# EasyEDA schematic Camera_IR.json
TITLE: Counter_Water; REV: 1.0; Date: 2025-07-06; Sheet: 1/1; Company: Museum of Science
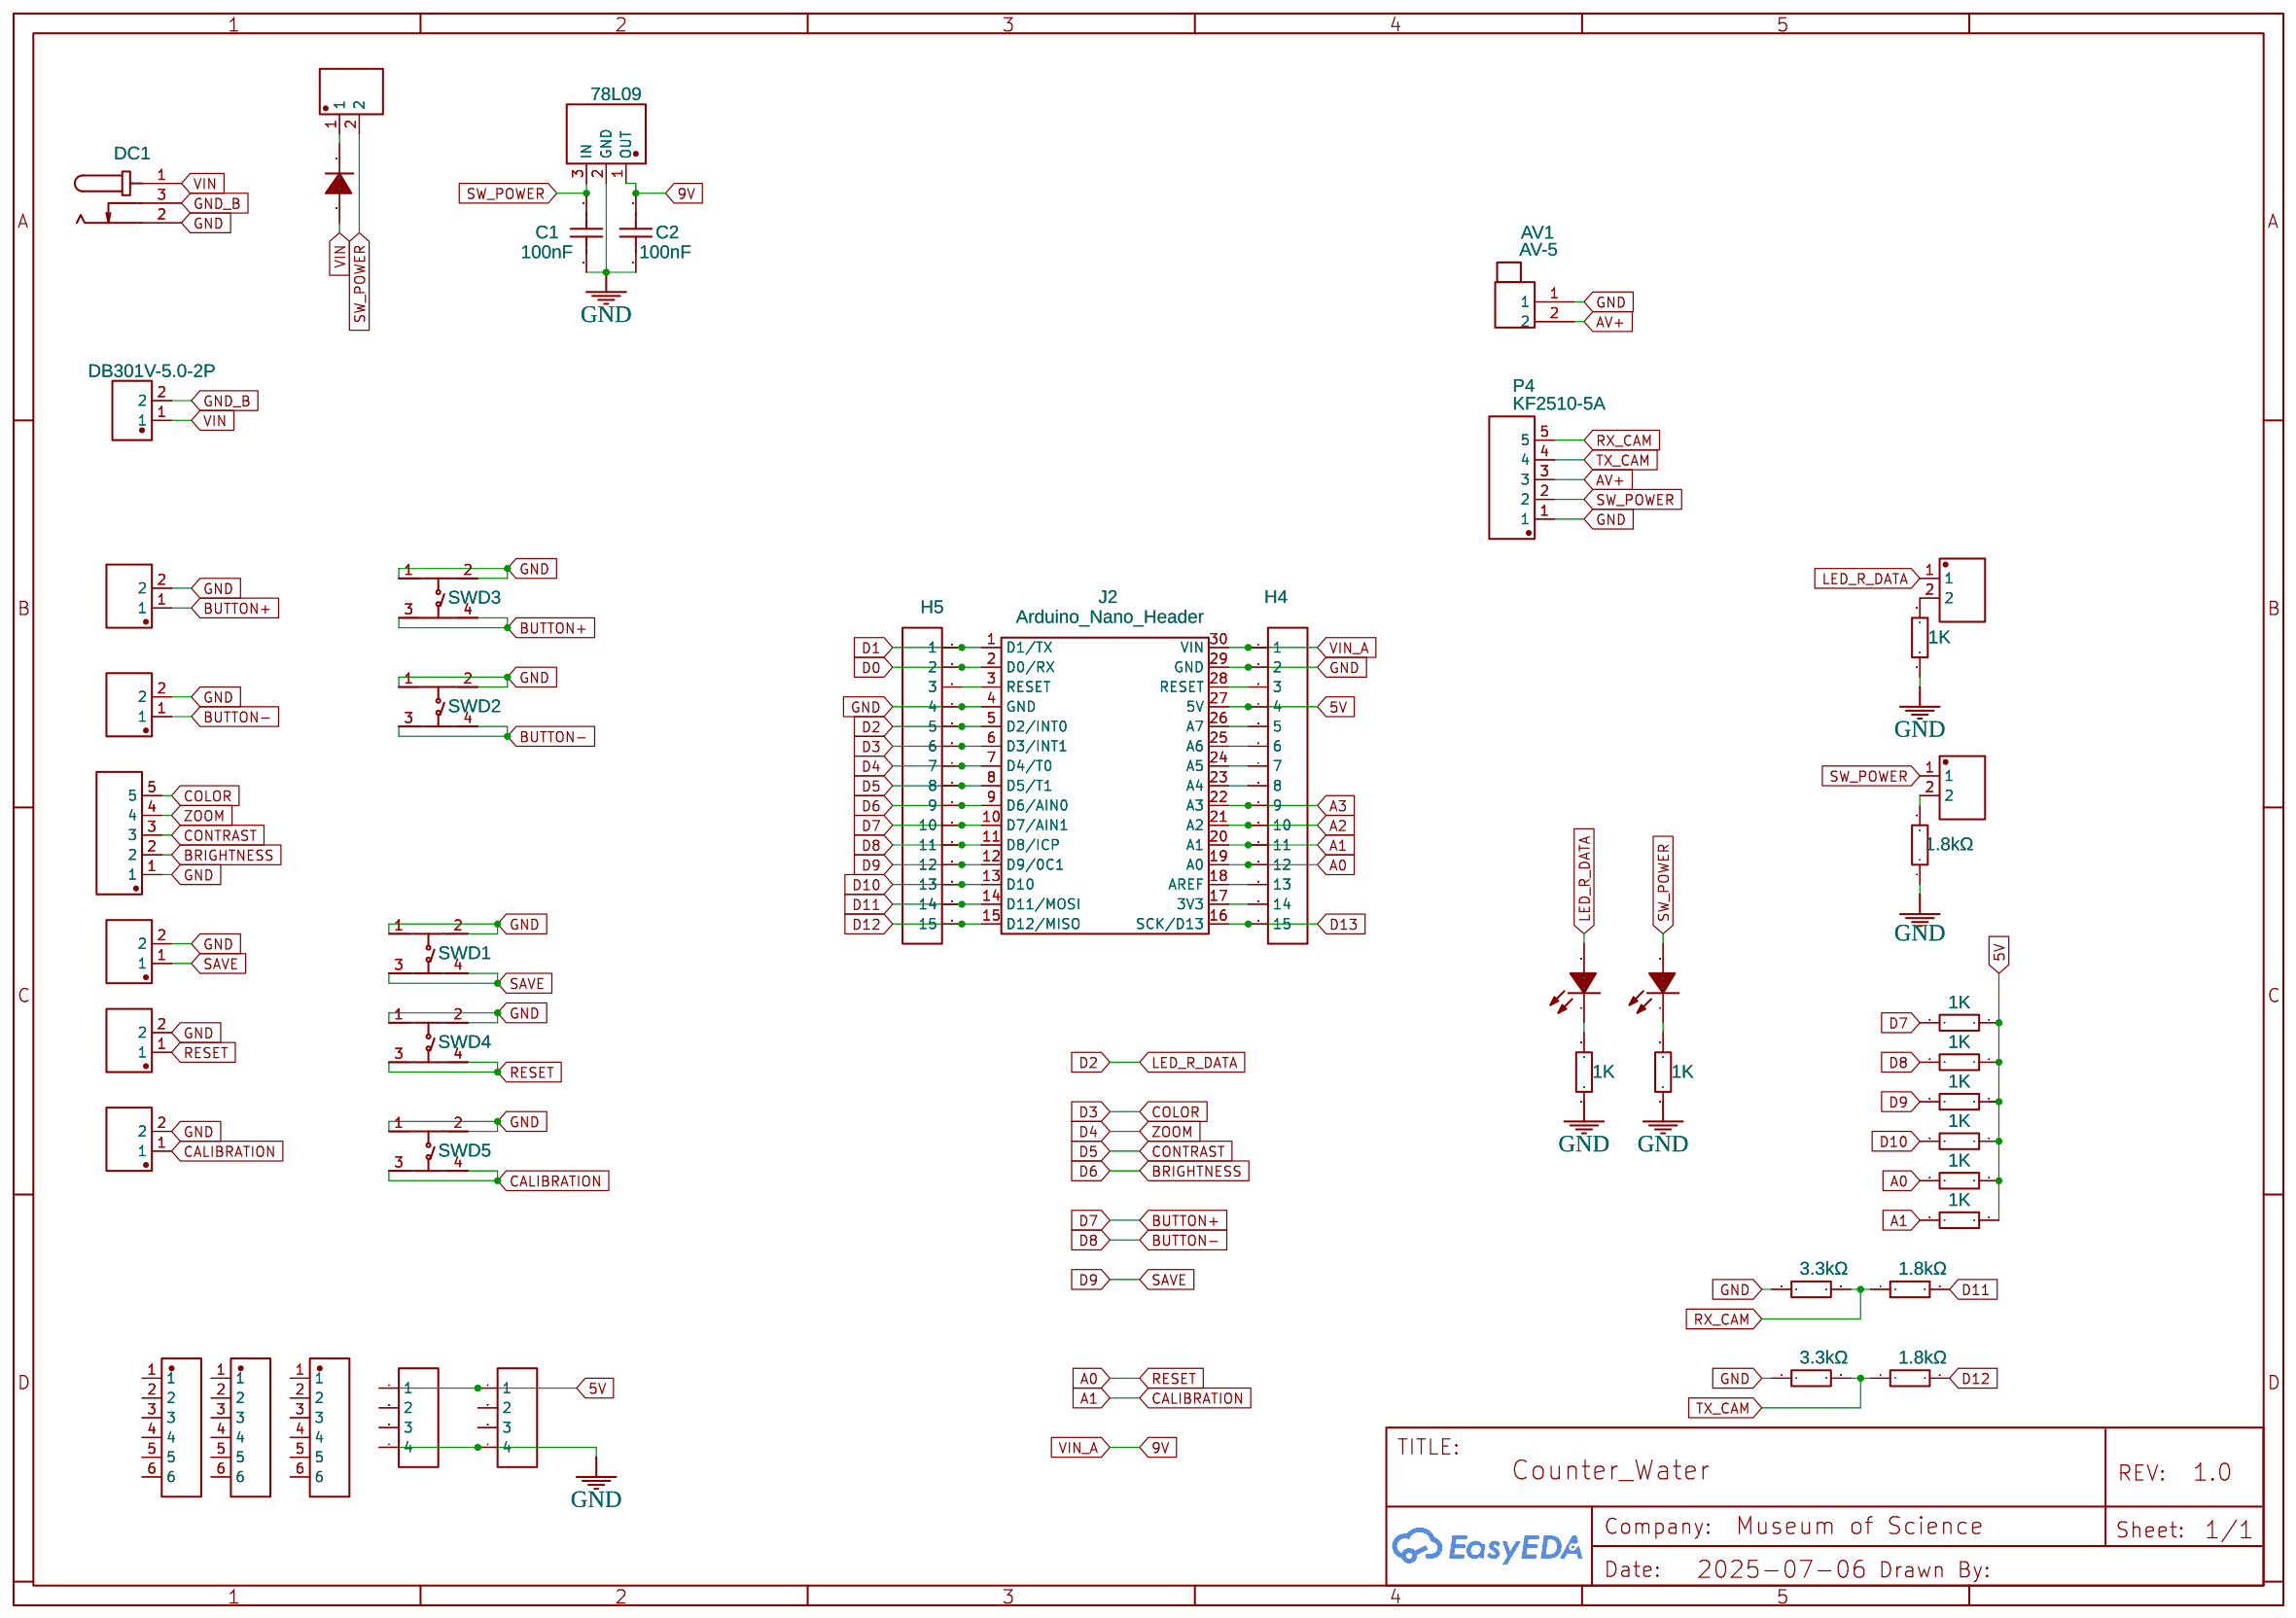
[diagram p0: schematic sheet]

## Parts
A0  RESET  [CONN-TH_KF2510-2A]
A1  FFC  [CONN-TH_KF2510-2A]
AV1  AV-5  [CONN-TH_AV-5]
C1  100nF  [C0603]
C2  100nF  [C0603]
D2  LED  [CONN-TH_KF2510-2A]
D7  B+  [CONN-TH_KF2510-2A]
D8  B-  [CONN-TH_KF2510-2A]
D9  SAVE  [CONN-TH_KF2510-2A]
DC1  DC  [DC-IN-TH_DC005]
DDM2  1N4007  [SMAF_L3.5-W2.6-LS4.7-RD]
ERL1  1K  [R0603]
ERL2  1K  [R0603]
ERL3  1K  [R0603]
ERL4  1K  [R0603]
ERL5  1K  [R0603]
ERL6  1K  [R0603]
ERL9  1K  [R0603]
ERL11  1K  [R0603]
ERL12  1K  [R0603]
H4  HDR-F-2.54_1x15  [HDR-F-2.54_1X15]
H5  HDR-F-2.54_1x15  [HDR-F-2.54_1X15]
J2  Arduino_Nano_Header  [DIP-30_L43.18-W15.24-ARDUINONANO]
J6  HDR-M-2.54_1x4  [HDR-M-2.54_1X4]
J7  HDR-M-2.54_1x4  [HDR-M-2.54_1X4]
LED4  KT-0603R  [LED0603-RD]
LED5  KT-0603R  [LED0603-RD]
LED_P  LED_POWER  [CONN-TH_KF2510-2A]
P1  KF2510-5A  [CONN-TH_5P-P2.54_KF2510-5A]
P2  H6  [HDR-TH_6P-P2.54-V-F]
P3  H6  [HDR-TH_6P-P2.54-V-F]
P4  KF2510-5A  [CONN-TH_5P-P2.54_KF2510-5A]
P5  H6  [HDR-TH_6P-P2.54-V-F]
R1  1.8kΩ  [R0603]
R2  1.8kΩ  [R0603]
R3  3.3kΩ  [R0402]
R4  3.3kΩ  [R0402]
R5  1.8kΩ  [R0603]
SW_P  SW_P  [CONN-TH_KF2510-2A]
SWD1  TC-6610-7-160G  [SW-TH_4P-L5.0-W5.0-P4.50-LS6.5]
SWD2  TC-6610-7-160G  [SW-TH_4P-L5.0-W5.0-P4.50-LS6.5]
SWD3  TC-6610-7-160G  [SW-TH_4P-L5.0-W5.0-P4.50-LS6.5]
SWD4  TC-6610-7-160G  [SW-TH_4P-L5.0-W5.0-P4.50-LS6.5]
SWD5  TC-6610-7-160G  [SW-TH_4P-L5.0-W5.0-P4.50-LS6.5]
U1  78L09  [SOT-89-3_L4.5-W2.5-P1.50-LS4.0-BR]
U3  DB301V-5.0-2P  [CONN-TH_2P-P5.00_L7.6-W10.0]

## Library data of the parts
A0 A1 D2 D7-D9 LED_P SW_P = KF2510-2A: Supplier: LCSC; Manufacturer: BOOMELE; Supplier Part: C27543; JLCPCB Part Class: Extended Part; Package Display: No
AV1 = AV-5: Supplier: LCSC; Manufacturer: BOOMELE(博穆精密); Supplier Part: C18080; JLCPCB Part Class: Extended Part
C1 C2 = CC0603KRX7R9BB104: Supplier: LCSC; Manufacturer: YAGEO(国巨); Supplier Part: C14663; JLCPCB Part Class: Basic Part
DC1 = DC005-2.0MM: Supplier: LCSC; Manufacturer: SOFNG; Supplier Part: C111567; Package Display: No
DDM2 = 1N4007F: Supplier: LCSC; Manufacturer: SK; Supplier Part: C110856; JLCPCB Part Class: Extended Part; Package Display: No
ERL1-ERL6 ERL9 ERL11 ERL12 = 0603WAF1001T5E: Supplier: LCSC; Manufacturer: UniOhm; Supplier Part: C21190; JLCPCB Part Class: Basic Part; Package Display: No
H4 H5 = HDR-F-2.54_1x15: Supplier Part: C124408; Supplier: LCSC; Contributor: LCEDA_Lib; Package Display: No
J2 = Arduino_Nano_Header
J6 J7 = HDR-M-2.54_1x4: Supplier Part: C124378; Supplier: LCSC; Contributor: LCEDA_Lib; Package Display: No
LED4 LED5 = KT-0603R: Supplier: LCSC; Manufacturer: KENTO; Supplier Part: C2286; JLCPCB Part Class: Basic Part
P1 P4 = KF2510-5A: Supplier: LCSC; Manufacturer: BOOMELE(博穆精密); Manufacturer Part: 2510-5A; Supplier Part: C27544; JLCPCB Part Class: Extended Part
P2 P3 P5 = Header-Female-2.54_1x6: Supplier: LCSC; Manufacturer: BOOMELE(博穆精密); Manufacturer Part: 2.54-1*6P母; Supplier Part: C40877; JLCPCB Part Class: Extended Part
R1 R2 R5 = 0603WAF1801T5E: Supplier: LCSC; Manufacturer: UNI-ROYAL(厚声); Supplier Part: C4177; JLCPCB Part Class: Basic Part
R3 R4 = 0402WGF3301TCE: Supplier: LCSC; Manufacturer: UNI-ROYAL(厚声); Supplier Part: C25890; JLCPCB Part Class: Basic Part
SWD1-SWD5 = TC-6610-7-160G: Contributor: LCSC; Supplier: LCSC; Supplier Part: C2845252; Manufacturer: HCTL(华灿天禄); JLCPCB Part Class: Extended Part; Package Display: No
U1 = 78L09U 78L09: Contributor: LCSC; Supplier: LCSC; Supplier Part: C2875177; Manufacturer: CBI(创基); JLCPCB Part Class: Extended Part; Package Display: No
U3 = DB301V-5.0-2P: Contributor: LCSC; Supplier: LCSC; Supplier Part: C395882; Manufacturer: DORABO(地博电气); Manufacturer Part: DB301V-5.0-2P-BU-S; JLCPCB Part Class: Extended Part

## Nets
5V: ERL2.1 ERL3.1 ERL6.1 ERL9.1 ERL11.1 ERL12.1 H4.4 J2.27(5V) J6.1 J7.1
9V: C2.2 H4.1 J2.30(VIN) U1.1(OUT)
GND: A0.2 A1.2 AV1.1 C1.1 C2.1 D7.2 D8.2 D9.2 DC1.2 ERL1.1 ERL4.1 ERL5.1 H4.2 H5.4 J2.4(GND) J2.29(GND) J6.4 J7.4 P1.1 P4.1 R3.1 R4.1 R5.1 SWD1.1 SWD1.2 SWD2.1 SWD2.2 SWD3.1 SWD3.2 SWD4.1 SWD4.2 SWD5.1 SWD5.2 U1.2(GND)
GND_B: DC1.3 U3.2
VIN: DC1.1 DDM2.2(A) U3.1
A0: A0.1 ERL2.2 H4.12 J2.19(A0) SWD4.3 SWD4.4
A1: A1.1 ERL3.2 H4.11 J2.20(A1) SWD5.3 SWD5.4
A2: H4.10 J2.21(A2)
A3: H4.9 J2.22(A3)
AV+: AV1.2 P4.3
BRIGHTNESS: H5.9 J2.9(D6/AIN0) P1.2
BUTTON+: D7.1 ERL6.2 H5.10 J2.10(D7/AIN1) SWD3.3 SWD3.4
BUTTON-: D8.1 ERL11.2 H5.11 J2.11(D8/ICP) SWD2.3 SWD2.4
COLOR: H5.6 J2.6(D3/INT1) P1.5
CONTRAST: H5.8 J2.8(D5/T1) P1.3
D0: H5.2 J2.2(D0/RX)
D1: H5.1 J2.1(D1/TX)
D2: D2.1 H5.5 J2.5(D2/INT0) LED5.2(A)
D4: H5.7 J2.7(D4/T0) P1.4
D9: D9.1 ERL9.2 H5.12 J2.12(D9/0C1) SWD1.3 SWD1.4
D10: ERL12.2 H5.13 J2.13(D10)
D11: H5.14 J2.14(D11/MOSI) R1.2
D12: H5.15 J2.15(D12/MISO) R2.2
D13: H4.15 J2.16(SCK/D13)
RX_CAM: P4.5 R1.1 R3.2
SW_POWER: C1.2 LED4.2(A) LED_P.1 P4.2 SW_P.2 U1.3(IN)
TX_CAM: P4.4 R2.1 R4.2
Net-(D2-2): D2.2 ERL5.2
Net-(DDM2-1): DDM2.1(C) SW_P.1
Net-(ERL1-2): ERL1.2 LED5.1(K)
Net-(ERL4-2): ERL4.2 LED4.1(K)
Net-(H4-3): H4.3 J2.28(RESET)
Net-(H4-5): H4.5 J2.26(A7)
Net-(H4-6): H4.6 J2.25(A6)
Net-(H4-7): H4.7 J2.24(A5)
Net-(H4-8): H4.8 J2.23(A4)
Net-(H4-13): H4.13 J2.18(AREF)
Net-(H4-14): H4.14 J2.17(3V3)
Net-(H5-3): H5.3 J2.3(RESET)
Net-(LED_P-2): LED_P.2 R5.2

Not connected (* = marked no-connect by the designer): J6 2 3; J7 2 3; P2 1 2 3 4 5 6; P3 1 2 3 4 5 6; P5 1 2 3 4 5 6
